# EAGLE schematic MK (EAGLE 9.6.2)
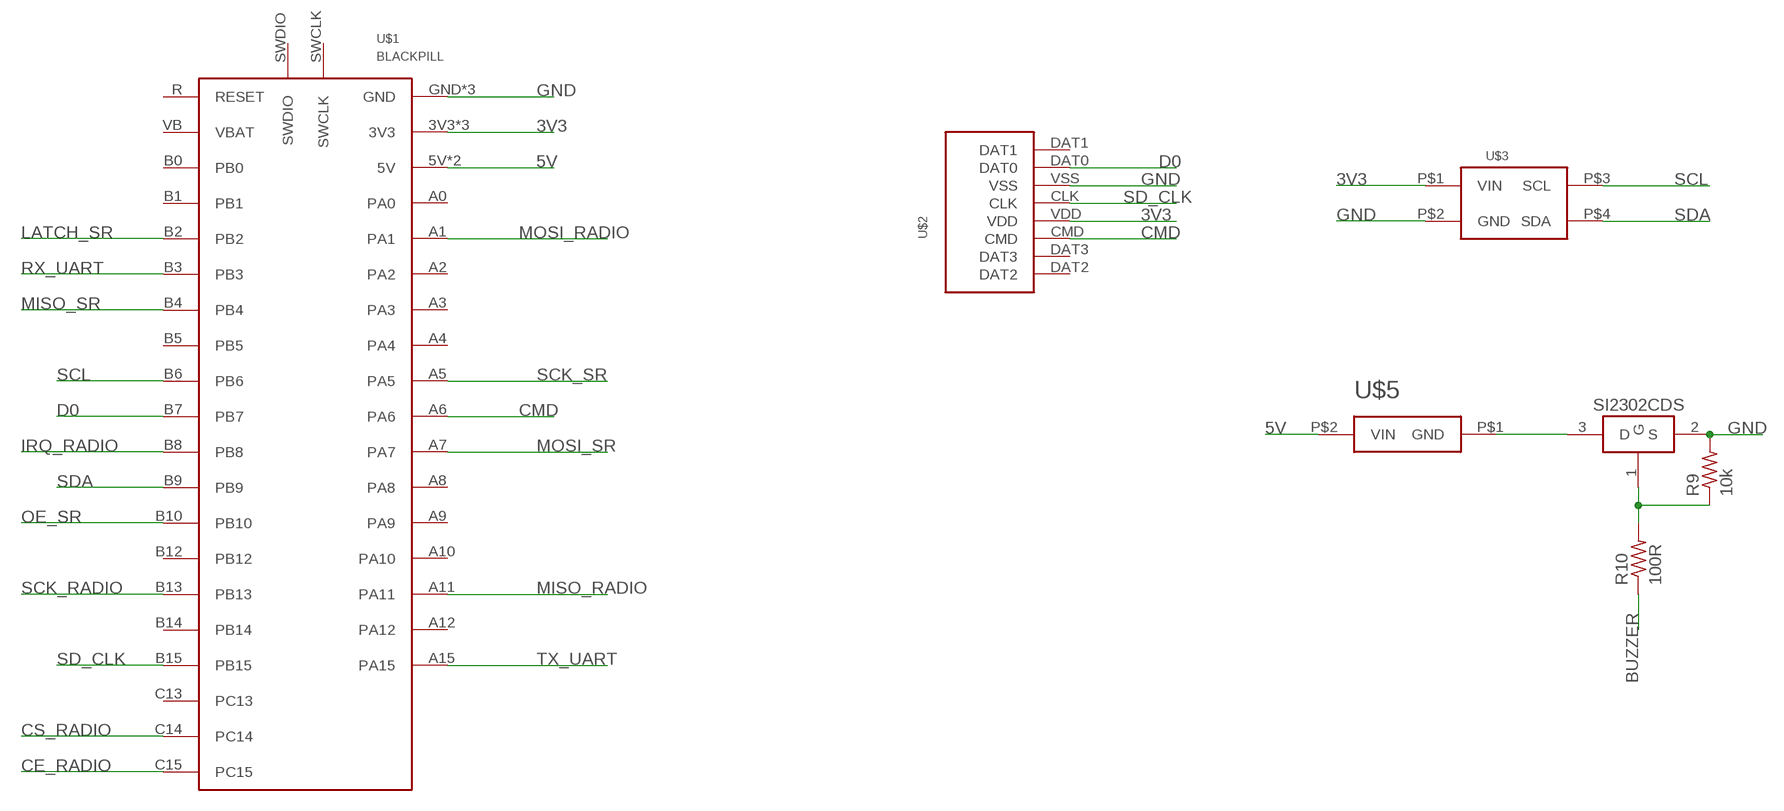
[diagram p0: schematic, sheet 1]

## Parts
R9  10k  R-US_R0603  [R0603]
R10  100R  R-US_R0603  [R0603]
U$1  BLACKPILL  [BLACKPILL]
U$2  SD  [SD]
U$3  BME280  [BME280]
U$5  BUZZERS8R6  [BUZZER-S8R12]
U$20  SI2302CDS  [SOT23-3]

## Nets
3V3: U$1.3V3 U$1.3V31(3V3) U$1.3V32(3V3) U$2.VDD U$3.P$1(VIN)
5V: U$1.5V U$1.5V1(5V) U$5.P$2(VIN)
BUZZER: R10.1
CE_RADIO: U$1.C15
CMD: U$1.A6 U$2.CMD
CS_RADIO: U$1.C14
D0: U$1.B7 U$2.DAT0
GND: R9.2 U$1.GND U$1.GND1(GND) U$1.GND3(GND) U$2.VSS U$3.P$2(GND) U$20.2(S)
IRQ_RADIO: U$1.B8
LATCH_SR: U$1.B2
MISO_RADIO: U$1.A11
MISO_SR: U$1.B4
MOSI_RADIO: U$1.A1
MOSI_SR: U$1.A7
N$13: U$5.P$1(GND) U$20.3(D)
N$14: R9.1 R10.2 U$20.1(G)
OE_SR: U$1.B10
RX_UART: U$1.B3
SCK_RADIO: U$1.B13
SCK_SR: U$1.A5
SCL: U$1.B6 U$3.P$3(SCL)
SD_CLK: U$1.B15 U$2.CLK
SDA: U$1.B9 U$3.P$4(SDA)
TX_UART: U$1.A15
Unconnected: U$1.A0 U$1.A2 U$1.A3 U$1.A4 U$1.A8 U$1.A9 U$1.A10 U$1.A12 U$1.B0 U$1.B1 U$1.B5 U$1.B12 U$1.B14 U$1.C13 U$1.R(RESET) U$1.SWCLK U$1.SWDIO U$1.VB(VBAT) U$2.DAT1 U$2.DAT2 U$2.DAT3

## Library data of the parts
R9 R10 = rcl:R-US_: RESISTOR, American symbol; SPICEPREFIX: R
U$1 = UNKNOWN-2024:BLACKPILL: BLUEPILL
U$2 = UNKNOWN-2024:SD
U$3 = UNKNOWN-2024:BME280
U$5 = CanCubeSat:BUZZER
U$20 = CanCubeSat:SI2302CDS